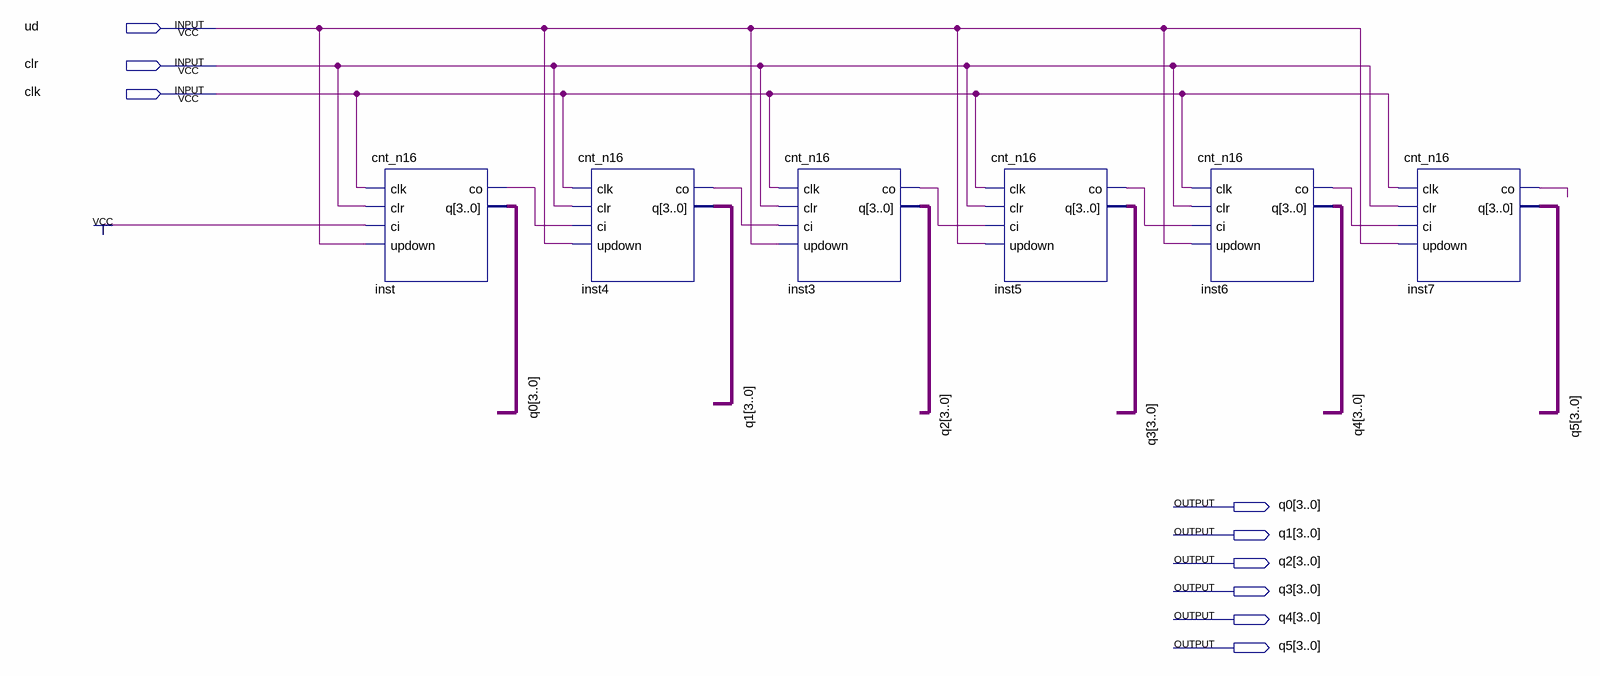
[diagram p0: schematic sheet]
// Quartus schematic cnt_n16x6.bdf as structural Verilog: 6 symbols, 9 pins
module cnt_n16x6 (
  input  ud,
  input  clr,
  input  clk,
  output [3:0] q0,
  output [3:0] q1,
  output [3:0] q2,
  output [3:0] q3,
  output [3:0] q4,
  output [3:0] q5
);

  wire inst3_co, inst4_co, inst5_co, inst6_co, inst7_co, inst_co;

  cnt_n16 inst (.clk(clk), .clr(clr), .ci(1'b1), .updown(ud), .co(inst_co), .q(q0));
  cnt_n16 inst4 (.clk(clk), .clr(clr), .ci(inst_co), .updown(ud), .co(inst4_co), .q(q1));
  cnt_n16 inst3 (.clk(clk), .clr(clr), .ci(inst4_co), .updown(ud), .co(inst3_co), .q(q2));
  cnt_n16 inst5 (.clk(clk), .clr(clr), .ci(inst3_co), .updown(ud), .co(inst5_co), .q(q3));
  cnt_n16 inst6 (.clk(clk), .clr(clr), .ci(inst5_co), .updown(ud), .co(inst6_co), .q(q4));
  cnt_n16 inst7 (.clk(clk), .clr(clr), .ci(inst6_co), .updown(ud), .co(inst7_co), .q(q5));
endmodule
